# EAGLE design maclight-v1 (EAGLE 7.0.0)
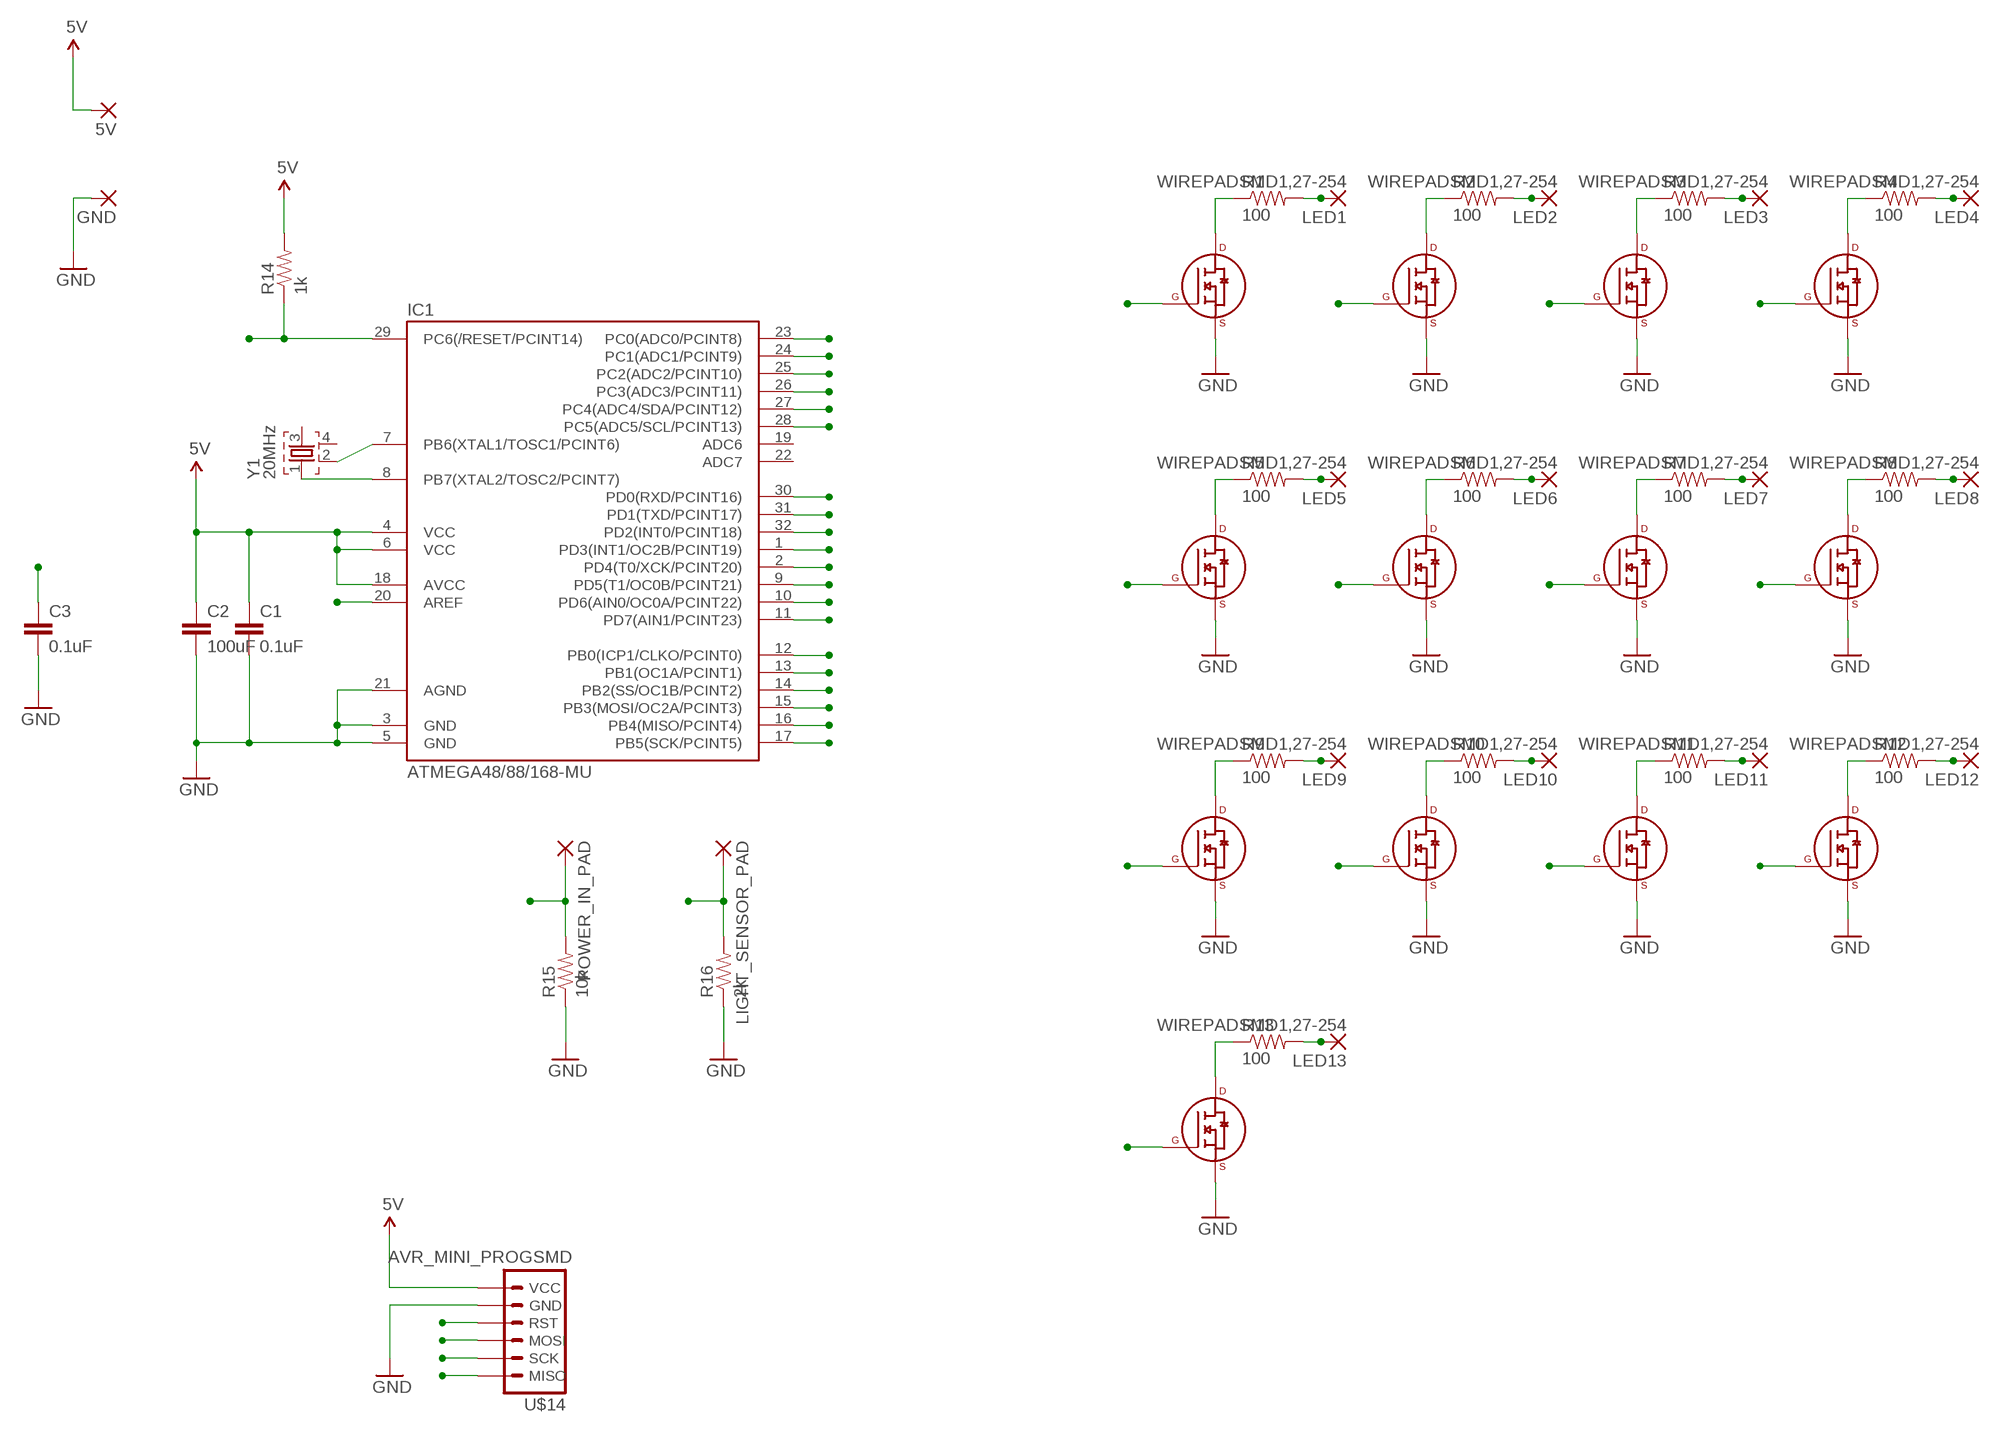
[diagram p0: schematic, sheet 1]

## Parts
5V  WIREPADSMD5-1,8  [5-1,8]
C1  0.1uF  CAP0805  [0805]
C2  100uF  CAP1206  [1206]
C3  0.1uF  CAP0805  [0805]
GND  WIREPADSMD5-1,8  [5-1,8]
IC1  ATMEGA48/88/168-MU  [MLF32]
LED1  WIREPADSMD1,27-254  [SMD1,27-2,54]
LED2  WIREPADSMD1,27-254  [SMD1,27-2,54]
LED3  WIREPADSMD1,27-254  [SMD1,27-2,54]
LED4  WIREPADSMD1,27-254  [SMD1,27-2,54]
LED5  WIREPADSMD1,27-254  [SMD1,27-2,54]
LED6  WIREPADSMD1,27-254  [SMD1,27-2,54]
LED7  WIREPADSMD1,27-254  [SMD1,27-2,54]
LED8  WIREPADSMD1,27-254  [SMD1,27-2,54]
LED9  WIREPADSMD1,27-254  [SMD1,27-2,54]
LED10  WIREPADSMD1,27-254  [SMD1,27-2,54]
LED11  WIREPADSMD1,27-254  [SMD1,27-2,54]
LED12  WIREPADSMD1,27-254  [SMD1,27-2,54]
LED13  WIREPADSMD1,27-254  [SMD1,27-2,54]
LIGHT_SENSOR_PAD  WIREPADSMD5-1,8  [5-1,8]
POWER_IN_PAD  WIREPADSMD5-1,8  [5-1,8]
R1  100  RESISTOR0805-RES  [0805]
R2  100  RESISTOR0805-RES  [0805]
R3  100  RESISTOR0805-RES  [0805]
R4  100  RESISTOR0805-RES  [0805]
R5  100  RESISTOR0805-RES  [0805]
R6  100  RESISTOR0805-RES  [0805]
R7  100  RESISTOR0805-RES  [0805]
R8  100  RESISTOR0805-RES  [0805]
R9  100  RESISTOR0805-RES  [0805]
R10  100  RESISTOR0805-RES  [0805]
R11  100  RESISTOR0805-RES  [0805]
R12  100  RESISTOR0805-RES  [0805]
R13  100  RESISTOR0805-RES  [0805]
R14  1k  RESISTOR0805-RES  [0805]
R15  10k  RESISTOR0805-RES  [0805]
R16  2k  RESISTOR0805-RES  [0805]
U$1  2N7000-2SOT-23  [SOT-23-3]
U$2  2N7000-2SOT-23  [SOT-23-3]
U$3  2N7000-2SOT-23  [SOT-23-3]
U$4  2N7000-2SOT-23  [SOT-23-3]
U$5  2N7000-2SOT-23  [SOT-23-3]
U$6  2N7000-2SOT-23  [SOT-23-3]
U$7  2N7000-2SOT-23  [SOT-23-3]
U$8  2N7000-2SOT-23  [SOT-23-3]
U$9  2N7000-2SOT-23  [SOT-23-3]
U$10  2N7000-2SOT-23  [SOT-23-3]
U$11  2N7000-2SOT-23  [SOT-23-3]
U$12  2N7000-2SOT-23  [SOT-23-3]
U$13  2N7000-2SOT-23  [SOT-23-3]
U$14  AVR_MINI_PROGSMD  [AVR_MINI_PROG]
Y1  20MHz  FA-20H  [FA-20H]

## Nets
5V: 5V.1(P) C1.1 C2.1 IC1.4(VCC) IC1.6(VCC) IC1.18(AVCC) R14.2 U$14.1(VCC)
/RESET: IC1.29(PC6(/RESET/PCINT14)) R14.1 U$14.3(RST)
AREF: C3.1 IC1.20(AREF)
GND: C1.2 C2.2 C3.2 GND.1(P) IC1.3(GND) IC1.5(GND) IC1.21(AGND) R15.1 R16.1 U$1.2(S) U$2.2(S) U$3.2(S) U$4.2(S) U$5.2(S) U$6.2(S) U$7.2(S) U$8.2(S) U$9.2(S) U$10.2(S) U$11.2(S) U$12.2(S) U$13.2(S) U$14.2(GND)
LED1: IC1.30(PD0(RXD/PCINT16)) U$1.1(G)
LED2: IC1.31(PD1(TXD/PCINT17)) U$2.1(G)
LED3: IC1.32(PD2(INT0/PCINT18)) U$3.1(G)
LED4: IC1.1(PD3(INT1/OC2B/PCINT19)) U$4.1(G)
LED5: IC1.2(PD4(T0/XCK/PCINT20)) U$5.1(G)
LED6: IC1.9(PD5(T1/OC0B/PCINT21)) U$6.1(G)
LED7: IC1.10(PD6(AIN0/OC0A/PCINT22)) U$7.1(G)
LED8: IC1.11(PD7(AIN1/PCINT23)) U$8.1(G)
LED9: IC1.12(PB0(ICP1/CLKO/PCINT0)) U$9.1(G)
LED10: IC1.13(PB1(OC1A/PCINT1)) U$10.1(G)
LED11: IC1.14(PB2(SS/OC1B/PCINT2)) U$11.1(G)
LIGHT_SENSOR: IC1.24(PC1(ADC1/PCINT9)) LIGHT_SENSOR_PAD.1(P) R16.2
MISO: IC1.16(PB4(MISO/PCINT4)) U$13.1(G) U$14.6(MISO)
MOSI: IC1.15(PB3(MOSI/OC2A/PCINT3)) U$12.1(G) U$14.4(MOSI)
N$2: IC1.7(PB6(XTAL1/TOSC1/PCINT6)) Y1.2
N$3: R1.1 U$1.3(D)
N$4: IC1.8(PB7(XTAL2/TOSC2/PCINT7)) Y1.1
N$6: R2.1 U$2.3(D)
N$7: IC1.25(PC2(ADC2/PCINT10))
N$9: R3.1 U$3.3(D)
N$10: IC1.26(PC3(ADC3/PCINT11))
N$11: IC1.27(PC4(ADC4/SDA/PCINT12))
N$12: R4.1 U$4.3(D)
N$15: R5.1 U$5.3(D)
N$18: R6.1 U$6.3(D)
N$21: R7.1 U$7.3(D)
N$24: R8.1 U$8.3(D)
N$27: R9.1 U$9.3(D)
N$30: R10.1 U$10.3(D)
N$33: R11.1 U$11.3(D)
N$35: IC1.28(PC5(ADC5/SCL/PCINT13))
N$36: R12.1 U$12.3(D)
N$39: R13.1 U$13.3(D)
OUT1: LED1.1(P) R1.2
OUT2: LED2.1(P) R2.2
OUT3: LED3.1(P) R3.2
OUT4: LED4.1(P) R4.2
OUT5: LED5.1(P) R5.2
OUT6: LED6.1(P) R6.2
OUT7: LED7.1(P) R7.2
OUT8: LED8.1(P) R8.2
OUT9: LED9.1(P) R9.2
OUT10: LED10.1(P) R10.2
OUT11: LED11.1(P) R11.2
OUT12: LED12.1(P) R12.2
OUT13: LED13.1(P) R13.2
POWER_IN: IC1.23(PC0(ADC0/PCINT8)) POWER_IN_PAD.1(P) R15.2
SCK: IC1.17(PB5(SCK/PCINT5)) U$14.5(SCK)
Unconnected: IC1.19(ADC6) IC1.22(ADC7) Y1.3 Y1.4

## Library data of the parts
5V GND LED1-LED13 LIGHT_SENSOR_PAD POWER_IN_PAD = wirepad:WIREPAD: Wire PAD connect wire on PCB
C1-C3 = SparkFun-Capacitors:CAP: Capacitor Standard 0603 ceramic capacitor, and 0.1" leaded capacitor.
IC1 = atmega8:ATMEGA48/88/168
R1-R16 = SparkFun-Resistors:RESISTOR: Resistor Basic schematic elements and footprints for 0603, 1206, and PTH resistors.
U$1-U$13 = Synapseware:2N7000-2: N-Channel Enhancement Mode Field Effect Transistor
U$14 = SparkFun-Connectors:AVR_MINI_PROG: AVR ISP 6-pin inline header
Y1 = crystal:FA-: MHz RANGE CRYSTAL UNIT Source: Epson Toyocom

## Board
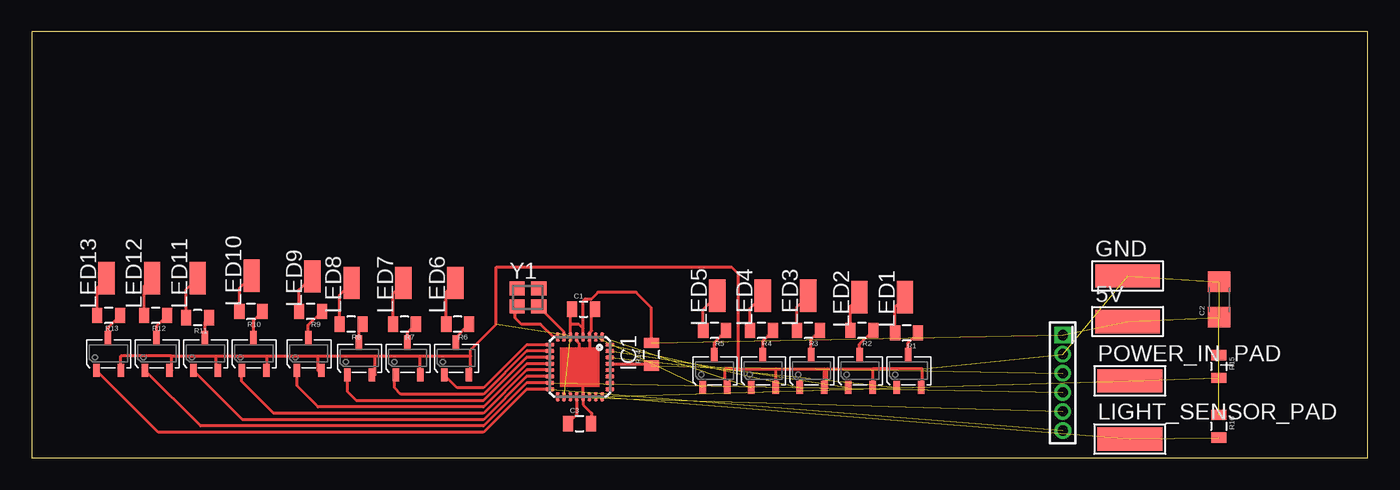
[diagram p1: board, top side]

Size 105 x 33.5 mm. Coordinates in mm from the lower left corner, seen from the top.
Outline: 0,0 105,0 105,33.5 0,33.5 0,0
Copper layers (1*16): Top 0.035mm / dielectric 1.5mm / Bottom 0.035mm
Design rules "default": minimum track width 10mil, minimum drill 24mil, track to track 8mil, track to pad 8mil, pad to pad 8mil, via to via 8mil, smd to smd 8mil, copper to edge 40mil, drill to drill 8mil, minimum pad ring 10mil, minimum via ring 8mil, stop-mask expansion 4mil, vias tented up to drill 0mil, thermal gap 10mil

### Footprints (pad centres in the part's own frame; a part is rotated, then mirrored left to right if it is on the bottom)
5-1,8 = smd 1.829 x 5.08: 1 0,0
0805 = smd 0.8 x 1.2: 1 -0.9,0; 2 0.9,0
1206 = smd 1.6 x 1.8: 1 -1.4,0; 2 1.4,0
MLF32 = smd 0.7 x 0.3: 1 -2.35,1.75; 2 -2.35,1.25; 3 -2.35,0.75; 4 -2.35,0.25; 5 -2.35,-0.25; 6 -2.35,-0.75; 7 -2.35,-1.25; 8 -2.35,-1.75; 17 2.35,-1.75; 18 2.35,-1.25; 19 2.35,-0.75; 20 2.35,-0.25; 21 2.35,0.25; 22 2.35,0.75; 23 2.35,1.25; 24 2.35,1.75 | smd 0.3 x 0.7: 9 -1.75,-2.35; 10 -1.25,-2.35; 11 -0.75,-2.35; 12 -0.25,-2.35; 13 0.25,-2.35; 14 0.75,-2.35; 15 1.25,-2.35; 16 1.75,-2.35; 25 1.75,2.35; 26 1.25,2.35; 27 0.75,2.35; 28 0.25,2.35; 29 -0.25,2.35; 30 -0.75,2.35; 31 -1.25,2.35; 32 -1.75,2.35
SMD1,27-2,54 = smd 1.27 x 2.54: 1 0,0
SOT-23-3 = smd 0.508 x 1.016: 1 -0.941,-1.312; 2 0.986,-1.312; 3 -0.03,1.282
AVR_MINI_PROG = drill 0.8 pad 1.27 square: 1 0,0 | drill 0.8 pad 1.27: 2 1.5,0; 3 3,0; 4 4.5,0; 5 6,0; 6 7.5,0.01
FA-20H = smd 1.2 x 1.1: 1 -0.85,-0.7; 2 0.85,-0.7; 3 0.85,0.7; 4 -0.85,0.7

### Placement (x,y rotation side)
5V  86.13,10.71 270 top
C1  43.36,11.68 0 top
C2  93.32,12.44 90 top
C3  43.05,2.68 0 top
GND  86.13,14.29 270 top
IC1  43.08,7.14 270 top
LED1  68.63,12.63 0 top
LED2  65.05,12.63 0 top
LED3  61.03,12.75 0 top
LED4  57.45,12.75 0 top
LED5  53.87,12.75 0 top
LED6  33.29,13.75 0 top
LED7  29.21,13.75 0 top
LED8  25.13,13.75 0 top
LED9  22.05,14.25 0 top
LED10  17.28,14.31 0 top
LED11  13.03,14.13 0 top
LED12  9.45,14.13 0 top
LED13  5.87,14.13 0 top
LIGHT_SENSOR_PAD  86.31,1.47 270 top
POWER_IN_PAD  86.31,6.05 270 top
R1  68.76,9.82 180 top
R2  65.24,10.01 180 top
R3  61.05,10.01 180 top
R4  57.36,10.01 180 top
R5  53.67,10.01 180 top
R6  33.48,10.51 180 top
R7  29.29,10.51 180 top
R8  25.1,10.51 180 top
R9  21.91,11.51 180 top
R10  17.22,11.51 180 top
R11  13.03,11.01 180 top
R12  9.74,11.2 180 top
R13  6.05,11.2 180 top
R14  48.7,8.14 90 top
R15  93.3,7.17 270 top
R16  93.3,2.48 270 top
U$1  68.91,6.83 0 top
U$2  65.1,6.83 0 top
U$3  61.29,6.83 0 top
U$4  57.48,6.83 0 top
U$5  53.67,6.83 0 top
U$6  33.36,7.83 0 top
U$7  29.55,7.83 0 top
U$8  25.74,7.83 0 top
U$9  21.76,8.18 0 top
U$10  17.45,8.18 0 top
U$11  13.64,8.18 0 top
U$12  9.83,8.18 0 top
U$13  6.02,8.18 0 top
U$14  81.03,9.64 270 top
Y1  38.99,12.6 0 top

### Tracks (layer width: path | path; a pad name or v marks a point on that pad's centre or on a via)
5V  (4 unrouted)
  Top 0.254: IC1.6 42.33,10.5 | 42.33,10.5 42.33,11.55 C1.1 | 42.33,10.5 43,10.5 43.33,10.17 IC1.4 43.33,12.33 43.5,12.5 44,12.5 44.5,13 47.5,13 48.7,11.8 R14.2
/RESET  (1 unrouted)
  Top 0.254: IC1.29 48.55,7.39 R14.1
AREF
  Top 0.254: IC1.20 42.83,3.36 C3.1
GND  (6 unrouted)
  Top 0.254: C3.2 44,2.73 44,3.5 43.33,4.17 IC1.21 43.33,5.83 43.5,6 43,6.5 43,8 | IC1.5 42.83,9.17 43,9 43,8 | C1.2 44,11.42 44,10 43.83,9.83 IC1.3 43.83,8.33 43.5,8 43,8 | U$13.2 7,8 11,8 | U$10.2 18.5,6.87 18.5,8 | U$6.2 34.5,6.52 34.5,8 | U$12.2 11,6.87 11,8 | 11,8 14.5,8 | U$11.2 14.5,6.87 14.5,8 | 14.5,8 18.5,8 | 18.5,8 22.5,8 | U$9.2 22.5,6.87 22.5,8 | 22.5,8 27,8 | 27,8 30.5,8 | U$7.2 30.5,6.52 30.5,8 | 30.5,8 34.5,8 | 34.5,8 34.5,8.5 36.5,10.5 36.5,15 55,15 55.5,14.5 55.5,7 | U$8.2 27,6.52 27,8 | U$5.2 54.5,5.52 54.5,7 55.5,7 | 55.5,7 58.47,7 U$4.2 58.5,5.52 58.5,7 62.28,7 U$3.2 62.5,5.52 62.5,7 66.09,7 | U$1.2 70,5.52 70,7 66.09,7 | 66.09,7 U$2.2
LED1  (1 unrouted)
LED2  (1 unrouted)
LED3  (1 unrouted)
LED4  (1 unrouted)
LED5  (1 unrouted)
LED6
  Top 0.254: IC1.9 38.89,8.89 35.5,5.5 33.44,5.5 U$6.1
LED7
  Top 0.254: IC1.10 38.89,8.39 35.5,5 29,5 28.5,5.5 28.5,6.41 U$7.1
LED8
  Top 0.254: IC1.11 38.89,7.89 35.5,4.5 25.5,4.5 24.8,5.2 U$8.1
LED9
  Top 0.254: IC1.12 38.89,7.39 35.5,4 22.5,4 20.82,5.68 U$9.1
LED10
  Top 0.254: IC1.13 38.89,6.89 35.5,3.5 19,3.5 16.5,6 U$10.1
LED11
  Top 0.254: IC1.14 38.89,6.39 35.5,3 16.57,3 U$11.1
LIGHT_SENSOR  (2 unrouted)
MISO  (1 unrouted)
  Top 0.254: IC1.16 38.89,5.39 35.5,2 9.95,2 U$13.1
MOSI  (1 unrouted)
  Top 0.254: IC1.15 38.89,5.89 35.5,2.5 13.26,2.5 U$12.1
N$2
  Top 0.254: IC1.7 41.83,9.91 Y1.2
N$3
  Top 0.254: U$1.3 68.88,9.04 R1.1
N$4
  Top 0.254: IC1.8 41.01,9.49 40,10.5 38.5,10.5 38,11 38,11.76 Y1.1
N$6
  Top 0.254: U$2.3 65.07,8.94 R2.1
N$9
  Top 0.254: U$3.3 61.26,9.32 R3.1
N$12
  Top 0.254: U$4.3 57.45,9.2 R4.1
N$15
  Top 0.254: U$5.3 53.64,9.08 R5.1
N$18
  Top 0.254: U$6.3 33.33,9.46 R6.1
N$21
  Top 0.254: U$7.3 29.52,9.84 R7.1
N$24
  Top 0.254: U$8.3 25.71,10.22 R8.1
N$27
  Top 0.254: U$9.3 21.73,10.43 R9.1
N$30
  Top 0.254: U$10.3 17.42,10.81 R10.1
N$33
  Top 0.254: U$11.3 13.61,10.69 R11.1
N$36
  Top 0.254: U$12.3 9.8,10.36 R12.1
N$39
  Top 0.254: U$13.3 5.99,10.24 R13.1
OUT1
  Top 0.254: R1.2 67.86,11.86 LED1.1
OUT2
  Top 0.254: R2.2 64.34,11.92 LED2.1
OUT3
  Top 0.254: R3.2 60.15,11.87 LED3.1
OUT4
  Top 0.254: R4.2 56.46,11.76 LED4.1
OUT5
  Top 0.254: R5.2 52.77,11.65 LED5.1
OUT6
  Top 0.254: R6.2 32.58,13.04 LED6.1
OUT7
  Top 0.254: R7.2 28.39,12.93 LED7.1
OUT8
  Top 0.254: R8.2 24.2,12.82 LED8.1
OUT9
  Top 0.254: R9.2 21.01,13.21 LED9.1
OUT10
  Top 0.254: R10.2 16.32,13.35 LED10.1
OUT11
  Top 0.254: R11.2 12.13,13.23 LED11.1
OUT12
  Top 0.254: R12.2 8.84,13.52 LED12.1
OUT13
  Top 0.254: R13.2 5.15,13.41 LED13.1
POWER_IN  (2 unrouted)
SCK  (1 unrouted)